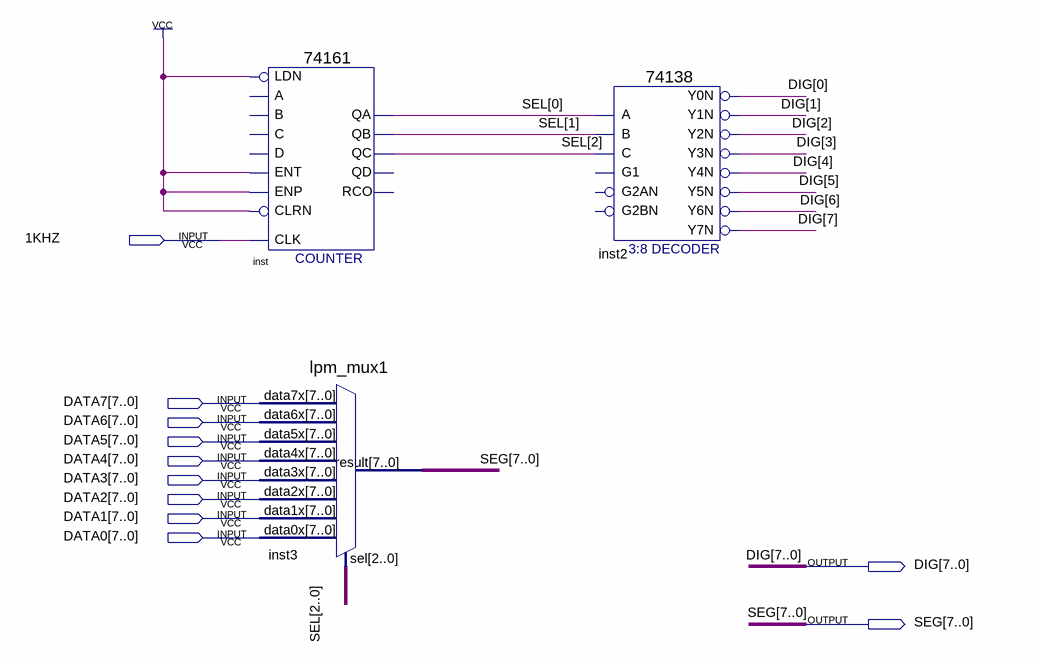
[diagram p0: schematic sheet]
// Quartus schematic SEG_Display.bdf as structural Verilog: 3 symbols, 11 pins
module SEG_Display (
  input  \1KHZ ,
  input  [7:0] DATA7,
  input  [7:0] DATA6,
  input  [7:0] DATA5,
  input  [7:0] DATA4,
  input  [7:0] DATA3,
  input  [7:0] DATA2,
  input  [7:0] DATA1,
  input  [7:0] DATA0,
  output [7:0] DIG,
  output [7:0] SEG
);

  wire [2:0] SEL;

  \74161  inst (
    .CLRN(1'b1), .CLK(\1KHZ ), .ENP(1'b1), .LDN(1'b1), .ENT(1'b1), .QC(SEL[2]), .QB(SEL[1]), .QA(SEL[0]));  // open: A, D, B, C, QD, RCO
  lpm_mux1 inst3 (
    .data7x(DATA7), .data6x(DATA6), .data5x(DATA5), .data4x(DATA4), .data3x(DATA3), .data2x(DATA2),
    .data1x(DATA1), .data0x(DATA0), .sel(SEL), .result(SEG));
  \74138  inst2 (
    .A(SEL[0]), .B(SEL[1]), .C(SEL[2]), .Y0N(DIG[0]), .Y1N(DIG[1]), .Y2N(DIG[2]), .Y3N(DIG[3]), .Y4N(DIG[4]),
    .Y5N(DIG[5]), .Y6N(DIG[6]), .Y7N(DIG[7]));  // open: G1, G2AN, G2BN
endmodule
